# Altium project led chaser.PrjPcb
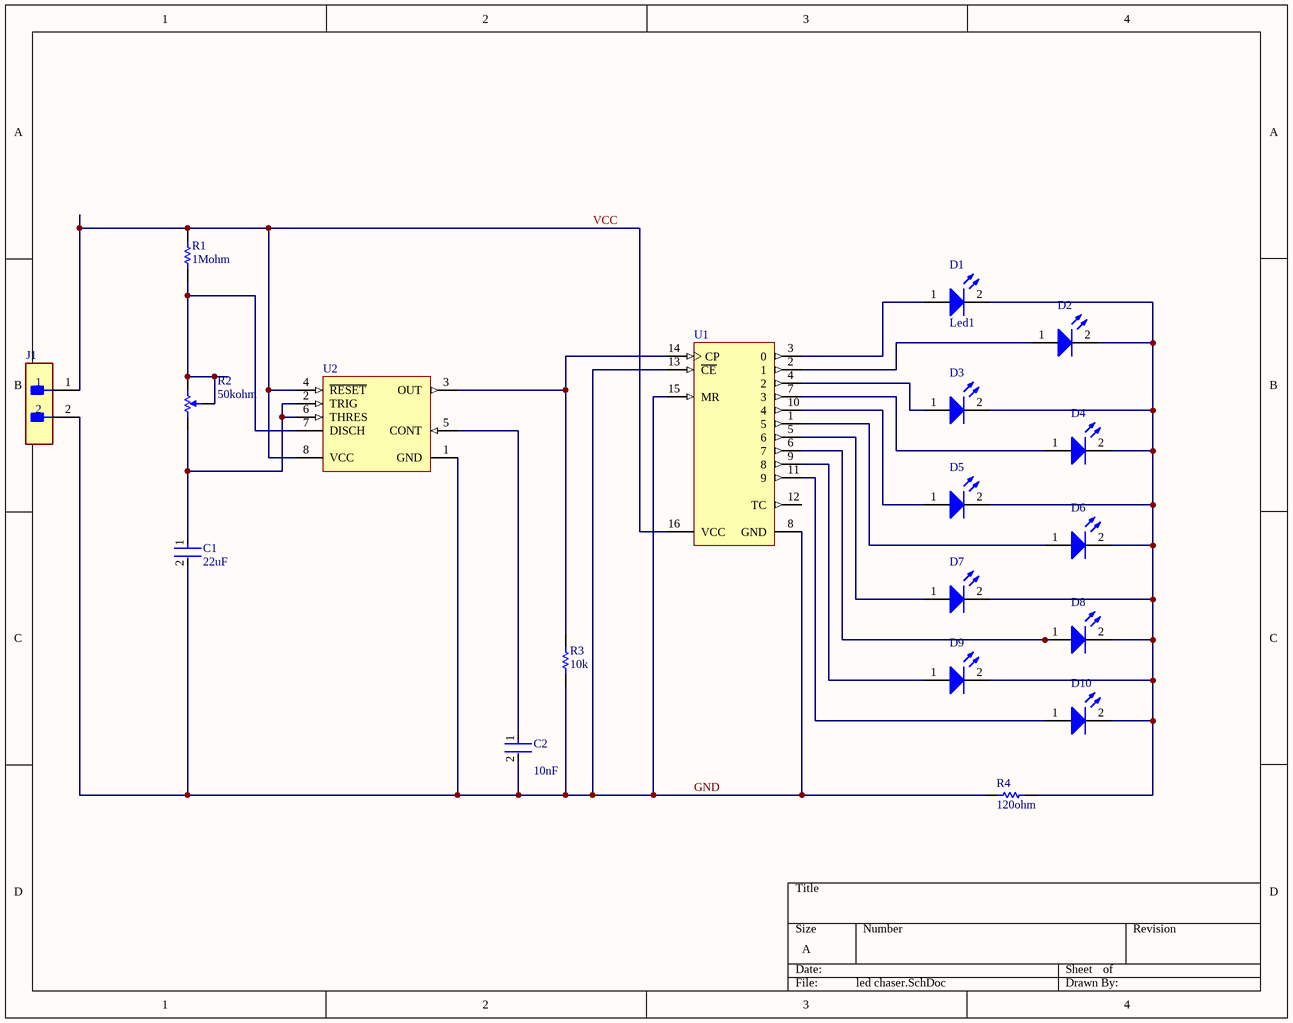
[diagram p0: led chaser.SchDoc]
1 sheet, 19 parts. Net scope: global (net labels, ports and power ports of the same name join across sheets).
Board file: led chaser.PcbDoc

## Sheet led chaser.SchDoc
size A

### Parts
C1  Capacitance: 22uF  [FP-RCE3M1-MFG]  (hidden comment: RCER71E106K3M1H03A)
C2  Capacitance: 10nF  [FP-RCE3M1-MFG]  (hidden comment: RCER71E106K3M1H03A)
D1  Led1  [WL-TMRC_D5.9H8.7]
D2  Led6  [WL-TMRC_D5.9H8.7]  (value not drawn)
D3  2  [WL-TMRC_D5.9H8.7]  (value not drawn)
D4  Led7  [WL-TMRC_D5.9H8.7]  (value not drawn)
D5  Led3  [WL-TMRC_D5.9H8.7]  (value not drawn)
D6  Led8  [WL-TMRC_D5.9H8.7]  (value not drawn)
D7  Led4  [WL-TMRC_D5.9H8.7]  (value not drawn)
D8  Led9  [WL-TMRC_D5.9H8.7]  (value not drawn)
D9  Led5  [WL-TMRC_D5.9H8.7]  (value not drawn)
D10  Led10  [WL-TMRC_D5.9H8.7]  (value not drawn)
J1  M20-9990246  [FP-M20-9990246-MFG]  (value not drawn)
R1  Resistance: 1Mohm  [RESA60-630X240]  (hidden comment: MFR-25FBF52-1M)
R2  50kohm  [BOUR-3313J-1_V]
R3  10k  [OMTE-RES7X2.5-2]
R4  120ohm  [OMTE-RES7X2.5-2]
U1  CD74HC4017E  [N0016A]  (value not drawn)
U2  NE555P  [P0008A]  (value not drawn)

### Nets
GND: C1.2 C2.2 J1.2 R3.1 R4.1 U1.8(GND) U1.13(~{CE}) U1.15(MR) U2.1(GND)
VCC: J1.1 R1.2 U1.16(VCC) U2.4(~{RESET}) U2.8(VCC)
NetC1_1: C1.1 R2.1 U2.2(TRIG) U2.6(THRES)
NetC2_1: C2.1 U2.5(CONT)
NetD1_1: D1.1(A) U1.3(0)
NetD1_2: D1.2(K) D2.2(K) D3.2(K) D4.2(K) D5.2(K) D6.2(K) D7.2(K) D8.2(K) D9.2(K) D10.2(K) R4.2
NetD2_1: D2.1(A) U1.2(1)
NetD3_1: D3.1(A) U1.4(2)
NetD4_1: D4.1(A) U1.7(3)
NetD5_1: D5.1(A) U1.10(4)
NetD6_1: D6.1(A) U1.1(5)
NetD7_1: D7.1(A) U1.5(6)
NetD8_1: D8.1(A) U1.6(7)
NetD9_1: D9.1(A) U1.9(8)
NetD10_1: D10.1(A) U1.11(9)
NetR1_1: R1.1 R2.2 R2.3 U2.7(DISCH)
NetR3_2: R3.2 U1.14(CP) U2.3(OUT)

Not connected (* = marked no-connect by the designer): U1 12(TC)

### Library data of the parts
C1 C2 = CMP-06035-005744-1: Cap Ceramic 10uF 25V X7R ±10% Radial 5mm +125°C Automotive Ammo Pack; Lead/Base Style: Formed Leads; Lead Diameter: 0.5mm; Length: 0.217inch; Package Quantity: 1500; Width: 0.157inch; Resistor Type: Ceramic; Height - Seated (Max): 0.197inch; Ratings: AEC-Q200; Lead Pitch: 0.197inch; Packaging: Tape and Reel; Tolerance: 10%; Voltage Rating (DC): 25V; Termination: Radial; Mount: Through Hole; Voltage Rating: 25V; Min Operating Temperature: -55°C; Height: 5mm; Dielectric: X7R; Max Operating Temperature: 125°C; Case/Package: Radial
D1-D10 = CMP-1488-00009-2: NexarPartId: 29717812; Test Current: 20mA; Forward Voltage: 3.2V; Wavelength: 470nm; Lens Size: 5mm; Lens Style: Circular, Diffused, Round; Forward Current: 100mA; Peak Wavelength: 465nm; Viewing Angle: 40°; Luminous Intensity: 500mcd; Max Reverse Voltage (DC): 5V; Color: Blue; Case/Package: Radial; Width: 5mm; Mount: Through Hole; Min Operating Temperature: -40°C; Length: 5mm; Height: 8.6mm; Max Operating Temperature: 85°C; Packaging: Bulk; RoHS: Compliant; REACH SVHC: Unknown; Dominant Wavelength: 470nm
J1 = CMP-15831-000009-1: CONN HEADER VERT 2POS 2.54MM; Manufacturer: Harwin; Conn Gender: Male; Description: Connector Header Through Hole 2 position 0.100" (2.54mm); Conn Orientation: Vertical; Number Of Contacts: 2; Current Rating: 3A; ComponentLink2URL: https://cdn.harwin.com/pdfs/M20-999.pdf; ComponentLink2Description: Datasheet; Package: M20-9990246; Temperature: -40°C to +105°C; Octopart: https://octopart.com/m20-9990246-harwin-2590635; Mouser Description: 2.54mm (0.1") Pitch SIL Vertical PC Tail Pin Header, 6.1mm mating pin height, tin, 2 contacts; Temperature Range High: +105°C; Device Class L1: Connectors; RoHS: TRUE; Automotive: No; Height: 8.99mm; Number Of Rows: 1; Contact Material: Tin,Nickel; Category: Conn; Pitch: 2.54mm; Lead Free: Yes; Digikey Description: CONN HEADER VERT 2POS 2.54MM; Manufacturer Part Number: M20-9990246; Temperature Range Low: -40°C; Device Class L3: unset; Device Class L2: Headers and Wire Housings
R1 = CMP-1659-00070-1: Axial Resistor, 1 MOhm, +/- 1%, 250 mW, -55 to 155 degC, 2-Pin THD, RoHS, Bulk; Power Rating: 250 mW; Voltage Rating: 250 V; ComponentLink1Description: Manufacturer URL; PackageReference: MFR-25; ComponentLink2Description: Datasheet; ComponentLink2URL: http://www.yageo.com/documents/recent/Yageo%20LR_MFR_2013.pdf; Tolerance: 1%; DatasheetVersion: Apr-13; Package Quantity: 200; Packaging: Bulk; Case\Package: Axial; RoHSCompliant: true; ComponentLink1URL: http://www.yageo.com/; Length: 0.248 inch; Min Operating Temperature: -55 degC; Mount: Through Hole; PackageDescription: 2-Pin Axial Lead, Dia 2.4 mm, Body Length 6.3 mm; Max Operating Temperature: 155 degC
R2 = CMP-2000-05588-1: 3 mm Trimpot(R) Trimming Potentiometer, 50 KOhm, +/- 20%, 0.125 W, -55 to 125 degC, 3-Pin SMD, RoHS, Tape and Reel; Manufacturer: Bourns; SVHC: NoSVHC(19-Dec-2012); Temperature Coefficient: ±150ppm/°C; No. of Turns: 1; Power Rating: 125mW; Manufacturer URL: http://www.bourns.com/; Potentiometer Mounting: SMD; Package Description: 3-Pin Surface Mount Device, Body 3.5 x 3.2 mm, Pitch 1.15 mm; Package Reference: 3313J-1; Mounting Technology: SurfaceMount; Resistance Tolerance: ±20%; Track Resistance: 50kohm; Datasheet Version: 05/2016; Datasheet URL: http://www.bourns.com/docs/Product-Datasheets/3313.pdf
R3 = CMP-2000-06865-1: Little Demon(R) Carbon Composition Molded OD Series, 250 V, 10 KOhm, +/-5%, -70 to 130 degC, 2-Pin THD, RoHS, Bulk; PartNumber: OD103JE; Manufacturer: Ohmite; Power Rating: 0.25W; Power (Watts): 0.25W,1/4W; Tolerance: ±5%; Online Catalog: OD,OF,OASeries,LittleDemon®; Catalog Drawings: OD,OF,OASeries; EDA / CAD Models: DownloadfromAcceleratedDesigns; Mounting Technology: ThroughHole; Datasheet Version: 06/2016; RoHS Information: LittleDemon"E"SeriesMaterialDeclaration; Number of Terminations: 2; Temperature Coefficient: -; Height: -; Resistance (Ohms): 10k; Composition: CarbonComposition; Package Description: 2-Pin THD Resistor, Body 7 x 2.5 mm, Lead Dia. 0.6 mm; Size / Dimension: 0.098"Diax0.276"L(2.50mmx7.00mm); Category: Resistors; Manufacturer URL: http://www.ohmite.com/; Features: PulseWithstanding; Family: ThroughHoleResistors; Supplier Device Package: Axial; Package / Case: Axial; Standard Package: 100; Package Reference: RES7X2.5; Operating Temperature: -; Series: LittleDemon®OD; Datasheet URL: http://www.ohmite.com/cat/res_od_of_oa.pdf; Packaging: Bulk
R4 = CMP-2000-06865-1: Little Demon(R) Carbon Composition Molded OD Series, 250 V, 10 KOhm, +/-5%, -70 to 130 degC, 2-Pin THD, RoHS, Bulk; PartNumber: OD103JE; Manufacturer: Ohmite; Resistance (Ohms): 10k; Power Rating: 0.25W; Power (Watts): 0.25W,1/4W; Tolerance: ±5%; Online Catalog: OD,OF,OASeries,LittleDemon®; Catalog Drawings: OD,OF,OASeries; EDA / CAD Models: DownloadfromAcceleratedDesigns; Mounting Technology: ThroughHole; Datasheet Version: 06/2016; RoHS Information: LittleDemon"E"SeriesMaterialDeclaration; Number of Terminations: 2; Temperature Coefficient: -; Height: -; Composition: CarbonComposition; Package Description: 2-Pin THD Resistor, Body 7 x 2.5 mm, Lead Dia. 0.6 mm; Size / Dimension: 0.098"Diax0.276"L(2.50mmx7.00mm); Category: Resistors; Manufacturer URL: http://www.ohmite.com/; Features: PulseWithstanding; Family: ThroughHoleResistors; Supplier Device Package: Axial; Package / Case: Axial; Standard Package: 100; Package Reference: RES7X2.5; Operating Temperature: -; Series: LittleDemon®OD; Datasheet URL: http://www.ohmite.com/cat/res_od_of_oa.pdf; Packaging: Bulk
U1 = CMP-1623-00548-2: High Speed CMOS Logic Decade Counter/Divider with 10 Decoded Outputs, N0016A, TUBE; Manufacturer: Texas Instruments; tpd @ Nom Voltage(Max)(ns): 54; Inputs: 1; Input Type: LVTTL/CMOS; Voltage(Nom)(V): 3.3,5; Schmitt Trigger: No; Output Drive (IOL/IOH)(Max)(mA): 5.2/-5.2; Bits(#): 10; VCC(Max)(V): 6; Technology Family: HC; ICC @ Nom Voltage(Max)(mA): 0.08; Rating: Catalog; F @ Nom Voltage(Max)(Mhz): 28; VCC(Min)(V): 2; Generic Part Number: CD74HC4017; Code_JEDEC: MS-001; DatasheetVersion: SCHS200D; Output Type: CMOS; Type: Decade; Operating Temperature Range(C): -55 to 125; PackageReference: N0016A; Function: Counter
U2 = CMP-2000-04954-1: Precision Timer, 4.5 to 16 V, 0 to 70 degC, 8-Pin DIP, Pb-Free, Tube; Manufacturer: TexasInstruments; Maximum High Level Output Current: -200mA; Number of Internal Timers: 1; Operating Supply Voltage: 5; Maximum Low Level Output Current: 200mA; Rad Hard: No; Packaging: Rail/Tube; Manufacturer URL: http://www.ti.com/; Package Reference: P8; Package Description: 8-Pin Double In-line Package, Body 9.59 x 6.35 mm, Pitch 2.54 mm; Package URL: http://www.ti.com/lit/ml/mpdi001b/mpdi001b.pdf; Type: Standard; Datasheet URL: http://www.ti.com/general/docs/lit/getliterature.tsp?genericPartNumber=NE555&fileType=pdf; Category: Timer; Package: 8PDIP; Datasheet Version: Rev. I, 09/2014